# EAGLE design waveformGenerator (EAGLE 7.5.0)
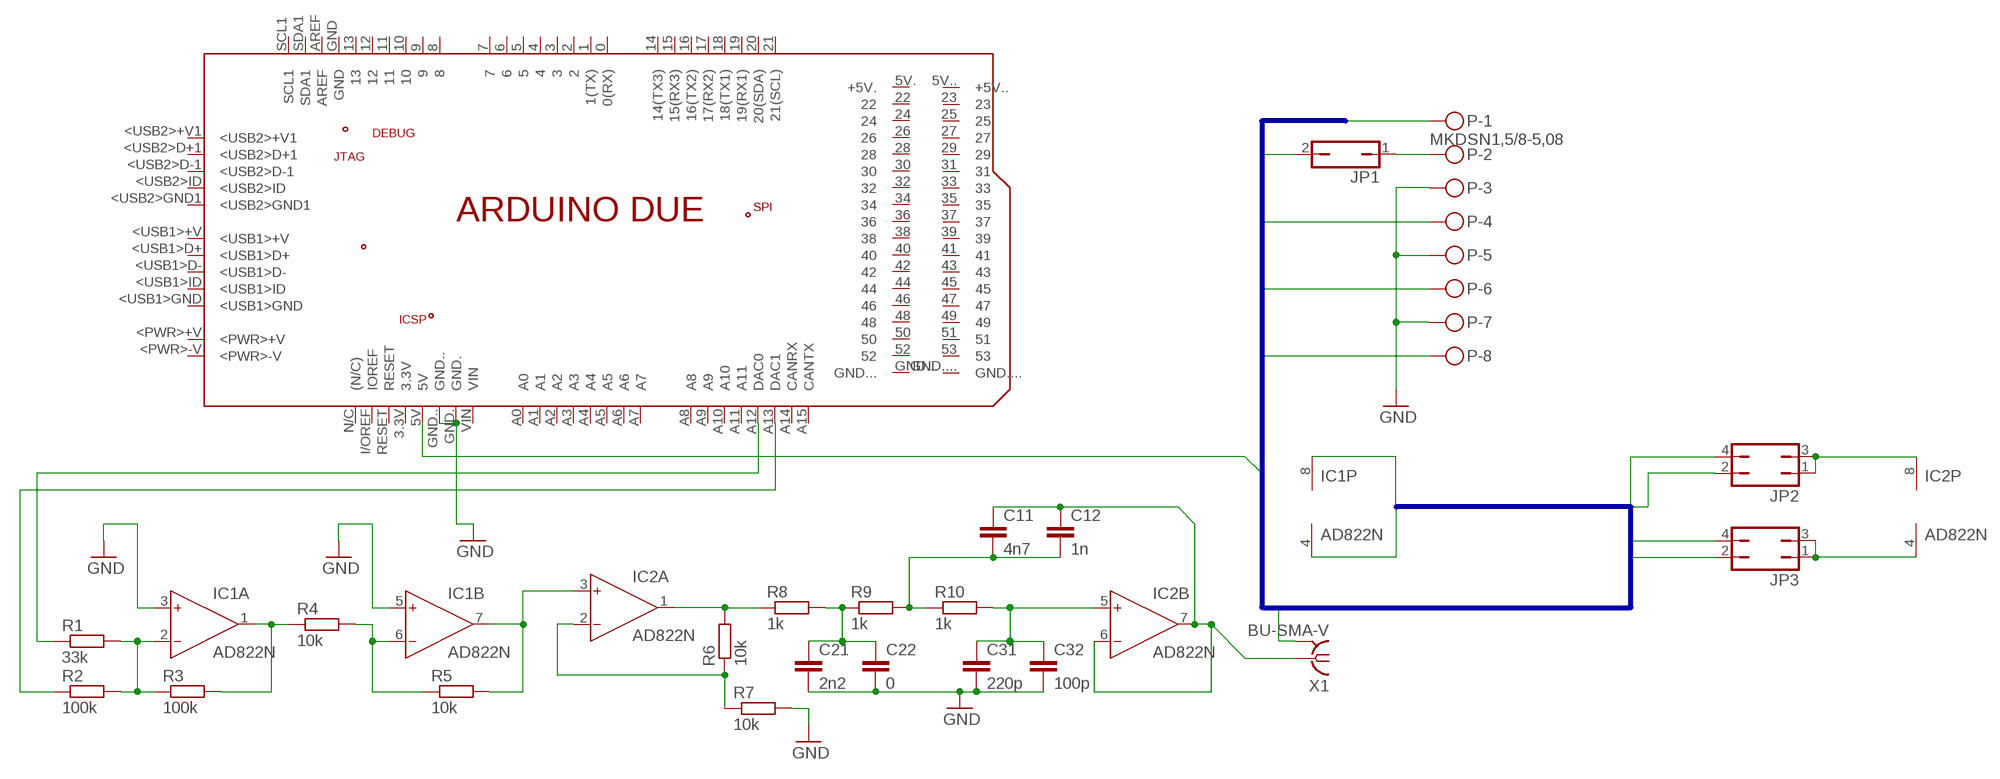
[diagram p0: schematic, sheet 1]

## Parts
C11  4n7  C-EU050-030X075  [C050-030X075]
C12  1n  C-EU050-030X075  [C050-030X075]
C21  2n2  C-EU050-030X075  [C050-030X075]
C22  0  C-EU050-030X075  [C050-030X075]
C31  220p  C-EU050-030X075  [C050-030X075]
C32  100p  C-EU050-030X075  [C050-030X075]
IC1  AD822N  [DIL08]
IC2  AD822N  [DIL08]
JP1  JP1Q  [JP1]
JP2  JP2Q  [JP2Q]
JP3  JP2Q  [JP2Q]
P  MKDSN1,5/8-5,08  [MKDSN1,5/8-5,08]
PCB1  ARDUINO_DUE  [ARDUINO_DUE]
R1  33k  R-EU_0207/10  [0207/10]
R2  100k  R-EU_0207/10  [0207/10]
R3  100k  R-EU_0207/10  [0207/10]
R4  10k  R-EU_0207/10  [0207/10]
R5  10k  R-EU_0207/10  [0207/10]
R6  10k  R-EU_0207/10  [0207/10]
R7  10k  R-EU_0207/10  [0207/10]
R8  1k  R-EU_0207/10  [0207/10]
R9  1k  R-EU_0207/10  [0207/10]
R10  1k  R-EU_0207/10  [0207/10]
X1  BU-SMA-V  [BU-SMA-V]

## Nets
+5: JP1.2 PCB1.5V
+15: IC1.8(P:V+) JP2.2 P.8
+24: JP2.4 P.4
-15: IC1.4(P:V-) JP3.2 P.6
GND: C21.2 C22.2 C31.2 C32.2 IC1.3(A:IN+) IC1.5(B:IN+) JP3.4 P.1 P.3 P.5 P.7 PCB1.GND. PCB1.GND.. R7.2 X1.2 X1.3 X1.4 X1.5
N$1: PCB1.A12(DAC0) R1.1
N$2: PCB1.A13(DAC1) R2.1
N$3: IC1.2(A:IN-) R1.2 R2.2 R3.1
N$4: JP1.1 P.2
N$5: IC1.1(A:OUT) R3.2 R4.1
N$6: IC1.6(B:IN-) R4.2 R5.1
N$7: IC1.7(B:OUT) IC2.3(A:IN+) R5.2
N$8: IC2.4(P:V-) JP3.1 JP3.3
N$9: IC2.8(P:V+) JP2.1 JP2.3
N$10: C11.1 C12.1 IC2.6(B:IN-) IC2.7(B:OUT) X1.1
N$11: IC2.2(A:IN-) R6.1 R7.1
N$12: IC2.1(A:OUT) R6.2 R8.1
N$14: C21.1 C22.1 R8.2 R9.1
N$15: C11.2 C12.2 R9.2 R10.1
N$16: C31.1 C32.1 IC2.5(B:IN+) R10.2
Unconnected: PCB1.0(0(RX)) PCB1.1(1(TX)) PCB1.2 PCB1.3 PCB1.3.3V PCB1.4 PCB1.5 PCB1.5V.(+5V.) PCB1.5V..(+5V..) PCB1.6 PCB1.7 PCB1.8 PCB1.9 PCB1.10 PCB1.11 PCB1.12 PCB1.13 PCB1.14(14(TX3)) PCB1.15(15(RX3)) PCB1.16(16(TX2)) PCB1.17(17(RX2)) PCB1.18(18(TX1)) PCB1.19(19(RX1)) PCB1.20(20(SDA)) PCB1.21(21(SCL)) PCB1.22 PCB1.23 PCB1.24 PCB1.25 PCB1.26 PCB1.27 PCB1.28 PCB1.29 PCB1.30 PCB1.31 PCB1.32 PCB1.33 PCB1.34 PCB1.35 PCB1.36 PCB1.37 PCB1.38 PCB1.39 PCB1.40 PCB1.41 PCB1.42 PCB1.43 PCB1.44 PCB1.45 PCB1.46 PCB1.47 PCB1.48 PCB1.49 PCB1.50 PCB1.51 PCB1.52 PCB1.53 PCB1.+3.3V PCB1.+5V PCB1.+5V_ PCB1.<PWR>+V PCB1.<PWR>-V PCB1.<USB1>+V PCB1.<USB1>D+ PCB1.<USB1>D- PCB1.<USB1>GND PCB1.<USB1>ID PCB1.<USB2>+V1 PCB1.<USB2>D+1 PCB1.<USB2>D-1 PCB1.<USB2>GND1 PCB1.<USB2>ID PCB1.A0 PCB1.A1 PCB1.A2 PCB1.A3 PCB1.A4 PCB1.A5 PCB1.A6 PCB1.A7 PCB1.A8 PCB1.A9 PCB1.A10 PCB1.A11 PCB1.A14(CANRX) PCB1.A15(CANTX) PCB1.AREF PCB1.GND PCB1.GND1 PCB1.GND1. PCB1.GND1.. PCB1.GND1... PCB1.GND... PCB1.GND.... PCB1.GND_ PCB1.GND__ PCB1.I/OREF(IOREF) PCB1.MISO PCB1.MISO2 PCB1.MOSI PCB1.MOSI2 PCB1.N/C((N/C)) PCB1.N/C. PCB1.RESET PCB1.RESET2 PCB1.RESET. PCB1.RESET.. PCB1.RESET_ PCB1.SCK PCB1.SCK2 PCB1.SCL1 PCB1.SDA1 PCB1.SWCLK PCB1.SWDIO PCB1.TCK PCB1.TDI PCB1.TDO PCB1.TMS PCB1.VIN

## Buses
GND,+5,+24,-15,+15

## Library data of the parts
C11 C12 C21 C22 C31 C32 = rcl:C-EU: CAPACITOR, European symbol
IC1 IC2 = analog-devices:AD822: Single-Supply, Rail-to-Rail Low Power FET-Input Op Amp Source: http://www.analog.com/static/imported-files/data_sheets/AD822.pdf; OC_FARNELL: 1438581; OC_NEWARK: unknown
JP1 = jumper:JP1Q: JUMPER
JP2 JP3 = jumper:JP2Q: JUMPER
P = con-phoenix-508:MKDSN1,5/8-5,08: MKDSN 1,5/ 8-5,08 Printklemme Nennstrom: 13,5 A Nennspannung: 250 V Rastermaß: 5,08 mm Polzahl: 8 Anschlussart: Schraubanschluss Montage: Löten Anschlussrichtung Leiter/Platine: 0 ° Artikelnummer: 1729186 Source: http://eshop.phoenixcontact.com .. 1729186.pdf
PCB1 = E14_Arduino_revB:ARDUINO_DUE: Device for representing an Arduino Due board with a footprint in an EAGLE design. Created by Dave Young for Element14. More EAGLE documentation at: http://www.element14.com/community/community/knode/cadsoft_eagle
R1-R10 = rcl:R-EU_: RESISTOR, European symbol
X1 = con-coax:BU-SMA-V: FEMALE SMA CONNECTOR Radiall distributor RS 112-3794; OC_FARNELL: unknown; OC_NEWARK: unknown

## Board
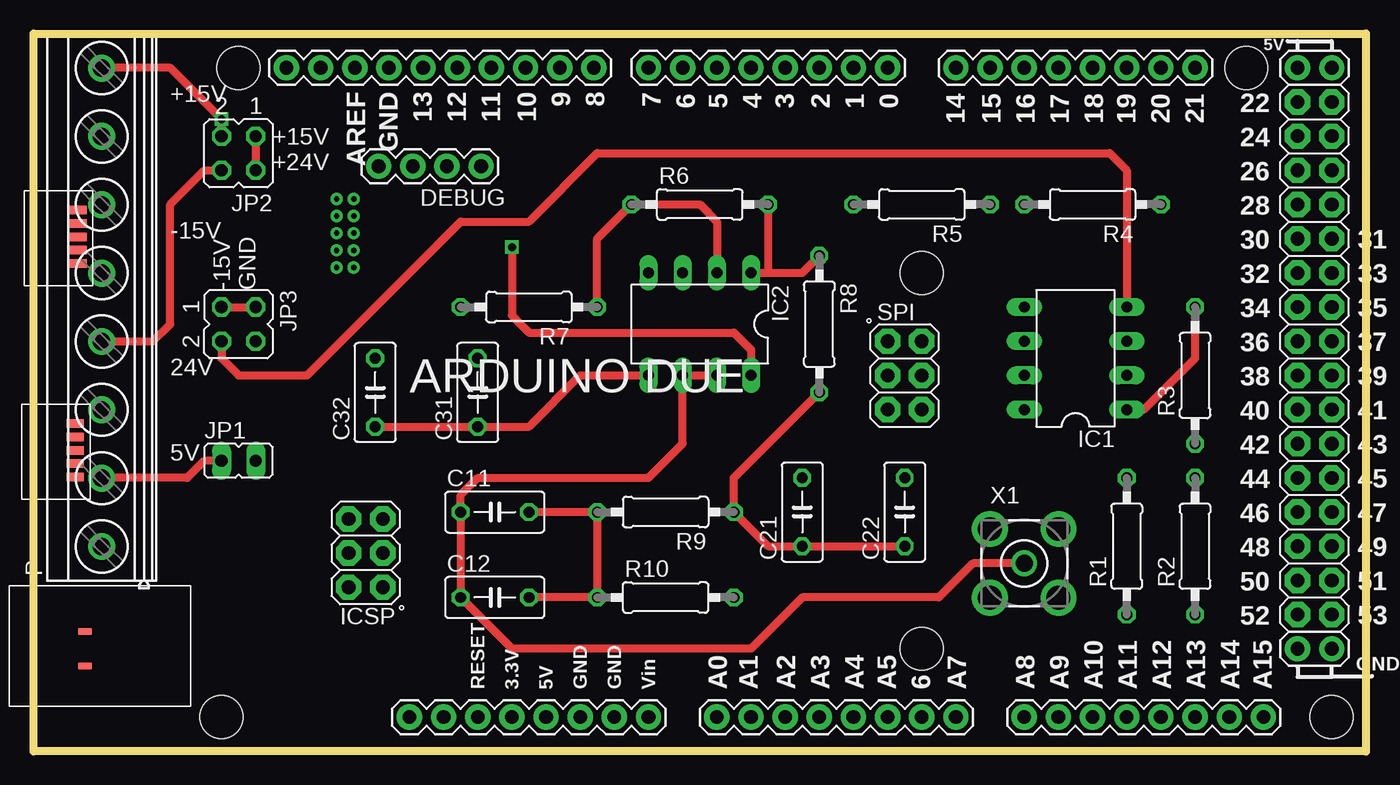
[diagram p1: board, top side]
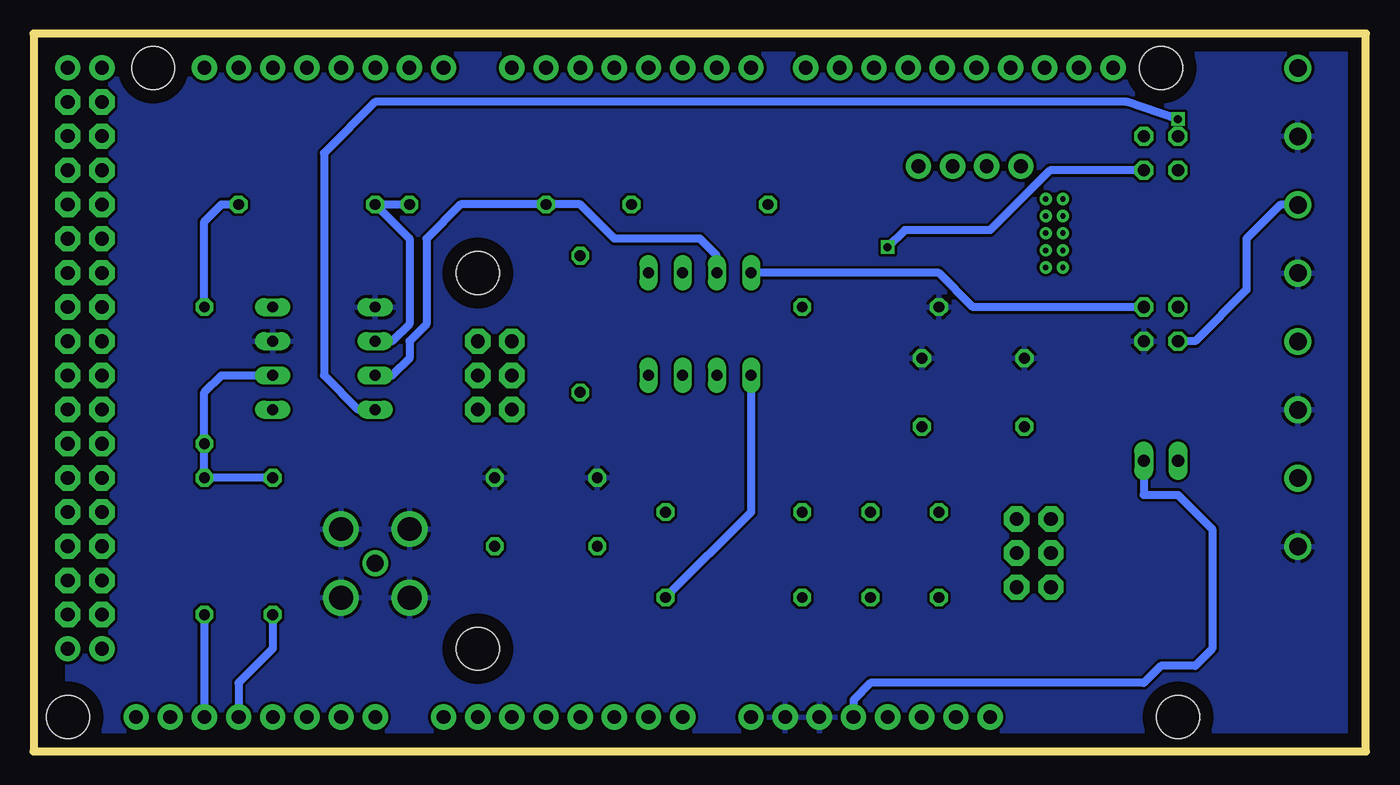
[diagram p2: board, bottom side, seen from below]

Size 99.06 x 53.34 mm. Coordinates in mm from the lower left corner, seen from the top.
Outline: 99.06,0 0,0 0,53.34 99.06,53.34 99.06,0
Copper layers (1*16): Top 0.035mm / dielectric 1.5mm / Bottom 0.035mm
Design rules "default": minimum track width 10mil, minimum drill 24mil, track to track 8mil, track to pad 8mil, pad to pad 8mil, via to via 8mil, smd to smd 8mil, copper to edge 40mil, drill to drill 8mil, minimum pad ring 10mil, minimum via ring 8mil, stop-mask expansion 4mil, vias tented up to drill 0mil, thermal gap 10mil

### Footprints (pad centres in the part's own frame; a part is rotated, then mirrored left to right if it is on the bottom)
C050-030X075 = drill 0.813 octagon: 1 -2.54,0; 2 2.54,0
DIL08 = drill 0.813 long: 1 -3.81,-3.81; 2 -1.27,-3.81; 3 1.27,-3.81; 4 3.81,-3.81; 5 3.81,3.81; 6 1.27,3.81; 7 -1.27,3.81; 8 -3.81,3.81
JP1 = drill 0.914 long: 1 0,-1.27; 2 0,1.27
JP2Q = drill 0.914 octagon: 1 -1.27,-1.27; 2 1.27,-1.27; 3 -1.27,1.27; 4 1.27,1.27
MKDSN1,5/8-5,08 = drill 1.3 pad 2: 1 -17.801,0.025; 2 -12.721,0.025; 3 -7.641,0.025; 4 -2.561,0.025; 5 2.519,0.025; 6 7.599,0.025; 7 12.679,0.025; 8 17.759,0.025
ARDUINO_DUE = drill 1.016 pad 1.88: 0 63.5,50.8; 1 60.96,50.8; 2 58.42,50.8; 3 55.88,50.8; 3.3V 35.56,2.54; 4 53.34,50.8; 5 50.8,50.8; 5V 38.1,2.54; 5V. 93.98,50.8; 5V.. 96.52,50.8; 6 48.26,50.8; 7 45.72,50.8; 8 41.656,50.8; 9 39.116,50.8; 10 36.576,50.8; 11 34.036,50.8; 12 31.496,50.8; 13 28.956,50.8; 14 68.58,50.8; 15 71.12,50.8; 16 73.66,50.8; 17 76.2,50.8; 18 78.74,50.8; 19 81.28,50.8; 20 83.82,50.8; 21 86.36,50.8; A0 50.8,2.54; A1 53.34,2.54; A2 55.88,2.54; A3 58.42,2.54; A4 60.96,2.54; A5 63.5,2.54; A6 66.04,2.54; A7 68.58,2.54; A8 73.66,2.54; A9 76.2,2.54; A10 78.74,2.54; A11 81.28,2.54; A12 83.82,2.54; A13 86.36,2.54; A14 88.9,2.54; A15 91.44,2.54; AREF 23.876,50.8; GND 26.416,50.8; GND1 33.274,43.485; GND. 43.18,2.54; GND.. 40.64,2.54; GND... 93.98,7.62; GND.... 96.52,7.62; I/OREF 30.48,2.54; N/C 27.94,2.54; RESET 33.02,2.54; RESET.. 25.654,43.485; SCL1 18.796,50.8; SDA1 21.336,50.8; SWCLK 30.734,43.485; SWDIO 28.194,43.485; VIN 45.72,2.54 | drill 1.016 pad 1.88 octagon: 22 93.98,48.26; 23 96.52,48.26; 24 93.98,45.72; 25 96.52,45.72; 26 93.98,43.18; 27 96.52,43.18; 28 93.98,40.64; 29 96.52,40.64; 30 93.98,38.1; 31 96.52,38.1; 32 93.98,35.56; 33 96.52,35.56; 34 93.98,33.02; 35 96.52,33.02; 36 93.98,30.48; 37 96.52,30.48; 38 93.98,27.94; 39 96.52,27.94; 40 93.98,25.4; 41 96.52,25.4; 42 93.98,22.86; 43 96.52,22.86; 44 93.98,20.32; 45 96.52,20.32; 46 93.98,17.78; 47 96.52,17.78; 48 93.98,15.24; 49 96.52,15.24; 50 93.98,12.7; 51 96.52,12.7; 52 93.98,10.16; 53 96.52,10.16; +5V 25.959,17.272; +5V_ 66.04,30.48; GND_ 25.959,12.192; GND__ 66.04,25.4; MISO 63.5,30.48; MISO2 23.419,17.272; MOSI 66.04,27.94; MOSI2 25.959,14.732; RESET2 23.419,12.192; RESET. 63.5,25.4; SCK 63.5,27.94; SCK2 23.419,14.732 | drill 0.406 pad 0.61: +3.3V 23.8,35.966; GND1. 23.8,37.236; GND1.. 23.8,38.506; GND1... 23.8,41.046; N/C. 23.8,39.776; RESET_ 22.53,41.046; TCK 22.53,37.236; TDI 22.53,39.776; TDO 22.53,38.506; TMS 22.53,35.966 | smd 1.016 x 0.508: <PWR>+V 3.81,8.89; <PWR>-V 3.81,6.35 | smd 1.27 x 0.635: <USB1>+V 3.099,24.359; <USB1>D+ 3.099,23.368; <USB1>D- 3.099,22.352; <USB1>GND 3.099,20.371; <USB1>ID 3.099,21.387; <USB2>+V1 3.302,40.234; <USB2>D+1 3.302,39.243; <USB2>D-1 3.302,38.227; <USB2>GND1 3.302,36.246; <USB2>ID 3.302,37.262 | hole 3.2: 15.24,50.8; 13.97,2.54; 66.04,35.56; 66.04,7.62; 90.17,50.8; 96.52,2.54
0207/10 = drill 0.813 octagon: 1 -5.08,0; 2 5.08,0
BU-SMA-V = drill 1.27: 1 0,0 | drill 1.778: 2 -2.55,2.55; 3 2.55,2.55; 4 2.55,-2.55; 5 -2.55,-2.55

### Placement (x,y rotation side)
C11  34.29,17.78 0 top
C12  34.29,11.43 0 top
C21  57.15,17.78 90 top
C22  64.77,17.78 90 top
C31  33.02,26.67 90 top
C32  25.4,26.67 90 top
IC1  77.47,29.21 90 top
IC2  49.53,31.75 180 top
JP1  15.24,21.59 270 top
JP2  15.24,44.45 180 top
JP3  15.24,31.75 270 top
P  5.08,33.02 90 top
PCB1  0,0 0 top
R1  81.28,15.24 90 top
R2  86.36,15.24 90 top
R3  86.36,27.94 90 top
R4  78.74,40.64 180 top
R5  66.04,40.64 180 top
R6  49.53,40.64 0 top
R7  36.83,33.02 180 top
R8  58.42,31.75 270 top
R9  46.99,17.78 180 top
R10  46.99,11.43 0 top
X1  73.66,13.97 0 top

### Tracks (layer width: path | path; a pad name or v marks a point on that pad's centre or on a via)
+5
  Bottom 0.61: JP1.2 16.51,19.05 13.97,19.05 11.43,16.51 11.43,7.62 12.7,6.35 15.24,6.35 16.51,5.08 36.83,5.08 38.1,3.81 PCB1.5V
+15  (via drill 0.6)
  Top 0.61: P.8 5.08,50.8 10.16,50.8 v13.97,46.99 JP2.2
  Bottom 0.61: v13.97,46.99 17.78,48.26 73.66,48.26 77.47,44.45 77.47,27.94 74.93,25.4 IC1.8
+24
  Top 0.61: P.4 8.87,30.46 10.16,31.75 10.16,40.64 12.7,43.18 JP2.4
-15
  Top 0.61: JP3.2 13.97,29.21 15.24,27.94 20.32,27.94 31.75,39.37 36.83,39.37 41.91,44.45 80.01,44.45 81.28,43.18 IC1.4
  Bottom 0.61: P.6 6.37,40.62 8.89,38.1 8.89,34.29 12.7,30.48 JP3.2
GND
  pour Bottom: 0,0 0,53.34 96.52,53.34 96.52,0
N$1
  Bottom 0.61: R1.1 81.28,7.62 83.82,5.08 PCB1.A12
N$2
  Bottom 0.61: R2.1 PCB1.A13
N$3
  Bottom 0.61: R1.2 R2.2 R3.1 86.36,26.67 85.09,27.94 IC1.2
N$4
  Top 0.61: JP1.1 12.7,21.59 11.43,20.32 5.08,20.32 P.2
N$5
  Top 0.61: IC1.1 82.55,25.4 86.36,29.21 R3.2
  Bottom 0.61: R3.2 86.36,39.37 85.09,40.64 R4.1
N$6
  Bottom 0.61: R5.1 R4.2 71.12,38.1 71.12,31.75 72.39,30.48 IC1.6
N$7
  Bottom 0.61: IC1.7 72.39,27.94 71.12,29.21 71.12,30.48 69.85,31.75 69.85,38.1 67.31,40.64 R5.2 58.42,40.64 55.88,38.1 49.53,38.1 48.26,36.83 IC2.3
N$8
  Top 0.61: JP3.1 JP3.3
  Bottom 0.61: JP3.3 29.21,33.02 31.75,35.56 IC2.4
N$9  (via drill 0.6)
  Top 0.61: JP2.1 JP2.3 | v35.56,37.47 35.56,32.38 36.83,31.11 52.07,31.11 53.34,29.84 IC2.8
  Bottom 0.61: JP2.3 23.5,43.18 27.94,38.73 34.29,38.73 v35.56,37.47
N$10
  Top 0.61: IC2.7 IC2.6 48.26,22.86 45.72,20.32 33.02,20.32 31.75,19.05 C11.1 C12.1 35.56,7.62 53.34,7.62 57.15,11.43 67.31,11.43 69.85,13.97 X1.1
N$11
  Top 0.61: R7.1 41.91,38.1 R6.1 49.53,40.64 50.8,39.37 IC2.2
N$12
  Top 0.61: IC2.1 54.61,35.56 | 54.61,35.56 57.15,35.56 R8.1 | R6.2 54.61,35.56
N$14
  Top 0.61: C22.1 C21.1 54.61,15.24 R9.1 52.07,20.32 R8.2
N$15
  Top 0.61: C12.2 R10.1 R9.2 C11.2
N$16
  Top 0.61: C32.1 C31.1 36.83,24.13 40.64,27.94 IC2.5
  Bottom 0.61: IC2.5 45.72,17.78 R10.2

### Text on the board
tPlace: +15V | +15V / +24V | -15V | -15V / GND | 24V | 5V